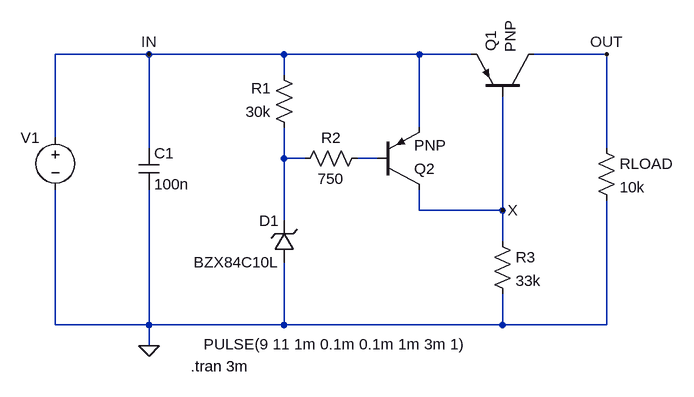
[diagram p0: schematic Overvoltage_Protection_v2.asc]
Overvoltage_Protection_v2.asc, the LTspice schematic file:
Version 4
SHEET 1 1040 680
WIRE -208 32 -352 32
WIRE 0 32 -208 32
WIRE 208 32 0 32
WIRE 288 32 208 32
WIRE 496 32 384 32
WIRE 0 64 0 32
WIRE 208 144 208 32
WIRE -352 160 -352 32
WIRE -208 176 -208 32
WIRE 496 176 496 32
WIRE 0 192 0 144
WIRE 32 192 0 192
WIRE 144 192 112 192
WIRE 208 272 208 240
WIRE 336 272 336 96
WIRE 336 272 208 272
WIRE 0 288 0 192
WIRE 336 320 336 272
WIRE -352 448 -352 240
WIRE -208 448 -208 240
WIRE -208 448 -352 448
WIRE 0 448 0 352
WIRE 0 448 -208 448
WIRE 336 448 336 400
WIRE 336 448 0 448
WIRE 496 448 496 256
WIRE 496 448 336 448
WIRE -208 480 -208 448
FLAG 496 32 OUT
FLAG 336 272 X
FLAG -208 32 IN
FLAG -208 480 0
SYMBOL res 16 160 R180
WINDOW 0 36 76 Left 2
WINDOW 3 36 40 Left 2
SYMATTR InstName R1
SYMATTR Value 30k
SYMBOL res 128 176 R90
WINDOW 0 0 56 VBottom 2
WINDOW 3 32 56 VTop 2
SYMATTR InstName R2
SYMATTR Value 750
SYMBOL res 320 304 R0
SYMATTR InstName R3
SYMATTR Value 33k
SYMBOL zener 16 352 R180
WINDOW 0 24 64 Left 2
WINDOW 3 24 0 Left 2
SYMATTR InstName D1
SYMATTR Value BZX84C10L
SYMBOL res 480 160 R0
SYMATTR InstName RLOAD
SYMATTR Value 10k
SYMBOL voltage -352 144 M0
WINDOW 3 -633 334 Left 2
WINDOW 123 0 0 Left 0
WINDOW 39 0 0 Left 0
SYMATTR Value PULSE(9 11 1m 0.1m 0.1m 1m 3m 1)
SYMATTR InstName V1
SYMBOL pnp 384 96 M270
WINDOW 3 67 36 Left 2
WINDOW 0 68 66 Left 2
SYMATTR InstName Q1
SYMBOL pnp 144 240 M180
SYMATTR InstName Q2
SYMBOL cap -224 176 R0
SYMATTR InstName C1
SYMATTR Value 100n
TEXT -144 512 Left 2 !.tran 3m

The netlist it stands for:
* Overvoltage_Protection_v2.asc
R1 N001 IN 30k
R2 N002 N001 750
R3 X 0 33k
D1 0 N001 BZX84C10L
RLOAD OUT 0 10k
V1 IN 0 PULSE(9 11 1m 0.1m 0.1m 1m 3m 1)
Q1 OUT X IN 0 PNP
Q2 X N002 IN 0 PNP
C1 IN 0 100n
.model D D
.lib standard.dio
.model NPN NPN
.model PNP PNP
.lib standard.bjt
.tran 3m
.backanno
.end